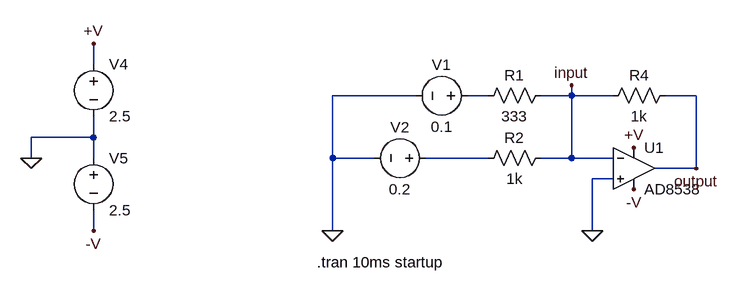
[diagram p0: schematic ADA853_8-9.asc]
ADA853_8-9.asc, the LTspice schematic file:
Version 4
SHEET 1 952 680
WIRE -608 -48 -608 -80
WIRE -112 0 -240 0
WIRE 0 0 -32 0
WIRE 128 0 128 -16
WIRE 128 0 80 0
WIRE 192 0 128 0
WIRE 320 0 272 0
WIRE -608 64 -608 32
WIRE -608 64 -704 64
WIRE -704 96 -704 64
WIRE -608 96 -608 64
WIRE -240 96 -240 0
WIRE -176 96 -240 96
WIRE 0 96 -96 96
WIRE 128 96 128 0
WIRE 128 96 80 96
WIRE 192 96 128 96
WIRE 320 112 320 0
WIRE 320 112 256 112
WIRE 192 128 160 128
WIRE -608 208 -608 176
WIRE -240 208 -240 96
WIRE 160 208 160 128
FLAG 160 208 0
FLAG -240 208 0
FLAG 320 112 output
FLAG 128 -16 input
FLAG 224 80 +V
FLAG 224 144 -V
FLAG -704 96 0
FLAG -608 -80 +V
FLAG -608 208 -V
SYMBOL res 96 -16 R90
WINDOW 0 0 56 VBottom 2
WINDOW 3 32 56 VTop 2
SYMATTR InstName R1
SYMATTR Value 333
SYMBOL res 96 80 R90
WINDOW 0 0 56 VBottom 2
WINDOW 3 32 56 VTop 2
SYMATTR InstName R2
SYMATTR Value 1k
SYMBOL voltage -16 0 R90
WINDOW 0 -32 56 VBottom 2
WINDOW 3 32 56 VTop 2
WINDOW 123 0 0 Left 0
WINDOW 39 0 0 Left 0
SYMATTR InstName V1
SYMATTR Value 0.1
SYMBOL voltage -80 96 R90
WINDOW 0 -32 56 VBottom 2
WINDOW 3 32 56 VTop 2
WINDOW 123 0 0 Left 0
WINDOW 39 0 0 Left 0
SYMATTR InstName V2
SYMATTR Value 0.2
SYMBOL res 288 -16 R90
WINDOW 0 0 56 VBottom 2
WINDOW 3 32 56 VTop 2
SYMATTR InstName R4
SYMATTR Value 1k
SYMBOL voltage -608 -64 R0
WINDOW 123 0 0 Left 0
WINDOW 39 0 0 Left 0
SYMATTR InstName V4
SYMATTR Value 2.5
SYMBOL voltage -608 80 R0
WINDOW 123 0 0 Left 0
WINDOW 39 0 0 Left 0
SYMATTR InstName V5
SYMATTR Value 2.5
SYMBOL OpAmps\\AD8538 224 48 R0
SYMATTR InstName U1
TEXT -264 256 Left 2 !.tran 10ms startup

The netlist it stands for:
* ADA853_8-9.asc
R1 input N001 333
R2 input N002 1k
V1 N001 0 0.1
V2 N002 0 0.2
R4 output input 1k
V4 +V 0 2.5
V5 0 -V 2.5
XU1 0 input +V -V output AD8538  ; pins In+ In- V+ V- OUT
.tran 10ms startup
.backanno
.end